# Altium project Unixtime Watch.PrjPcb
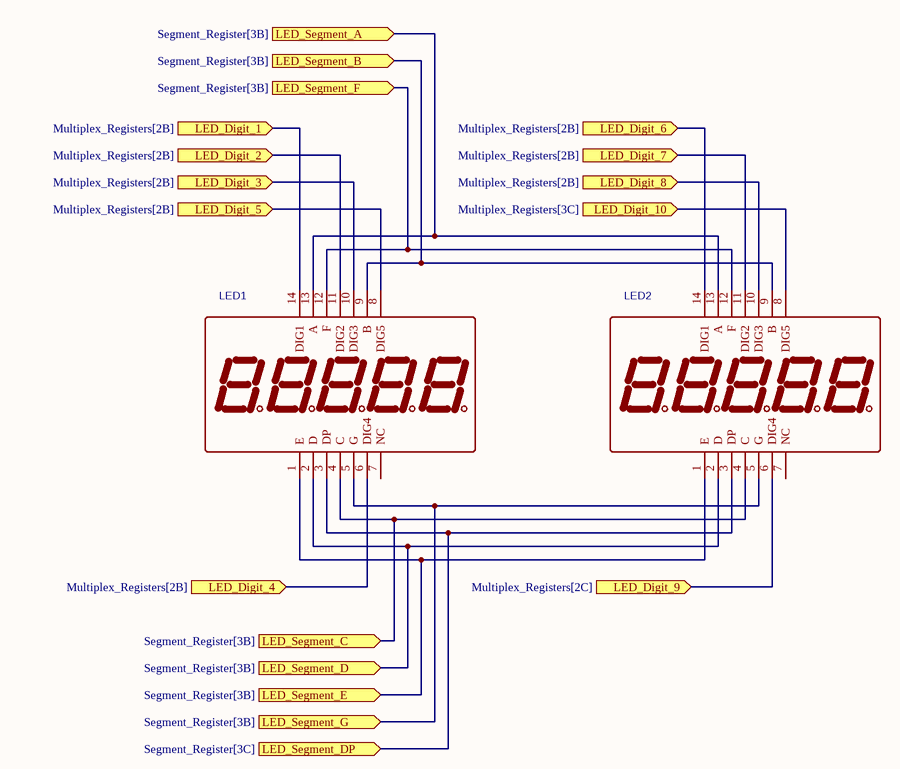
[diagram p0: LEDs.SchDoc]
6 sheets, 32 parts. Net scope: flat (ports and power ports of the same name join across sheets).
Board file: PCB1.PcbDoc
Sheets:
  LEDs.SchDoc
  Multiplex_Registers.SchDoc
  Segment_Register.SchDoc
  Micro.SchDoc
  Power_Management.SchDoc
  RV-3028.SchDoc

## Sheet LEDs.SchDoc
size A; SheetNumber: 1; SheetTotal: 6

### Parts
LED1  SLR0365CRA1BD/AFN-3651A  [LED-SEG-TH_SLR0365CRA1BD-AFN-3651A]  (value not drawn)
LED2  SLR0365CRA1BD/AFN-3651A  [LED-SEG-TH_SLR0365CRA1BD-AFN-3651A]  (value not drawn)

### Ports
LED_Digit_1 (in, see Multiplex_Registers[2B]), LED_Digit_2 (in, see Multiplex_Registers[2B]), LED_Digit_3 (in, see Multiplex_Registers[2B]), LED_Digit_4 (in, see Multiplex_Registers[2B]), LED_Digit_5 (in, see Multiplex_Registers[2B]), LED_Digit_6 (in, see Multiplex_Registers[2B]), LED_Digit_7 (in, see Multiplex_Registers[2B]), LED_Digit_8 (in, see Multiplex_Registers[2B]), LED_Digit_9 (in, see Multiplex_Registers[2C]), LED_Digit_10 (in, see Multiplex_Registers[3C]), LED_Segment_A (in, see Segment_Register[3B]), LED_Segment_B (in, see Segment_Register[3B]), LED_Segment_C (in, see Segment_Register[3B]), LED_Segment_D (in, see Segment_Register[3B]), LED_Segment_DP (in, see Segment_Register[3C]), LED_Segment_E (in, see Segment_Register[3B]), LED_Segment_F (in, see Segment_Register[3B]), LED_Segment_G (in, see Segment_Register[3B])

### Nets
NetLED1_1: LED1.1(E) LED2.1(E) ; port LED_Segment_E
NetLED1_2: LED1.2(D) LED2.2(D) ; port LED_Segment_D
NetLED1_3: LED1.3(DP) LED2.3(DP) ; port LED_Segment_DP
NetLED1_4: LED1.4(C) LED2.4(C) ; port LED_Segment_C
NetLED1_5: LED1.5(G) LED2.5(G) ; port LED_Segment_G
NetLED1_6: LED1.6(DIG4) ; port LED_Digit_4
NetLED1_8: LED1.8(DIG5) ; port LED_Digit_5
NetLED1_9: LED1.9(B) LED2.9(B) ; port LED_Segment_B
NetLED1_10: LED1.10(DIG3) ; port LED_Digit_3
NetLED1_11: LED1.11(DIG2) ; port LED_Digit_2
NetLED1_12: LED1.12(F) LED2.12(F) ; port LED_Segment_F
NetLED1_13: LED1.13(A) LED2.13(A) ; port LED_Segment_A
NetLED1_14: LED1.14(DIG1) ; port LED_Digit_1
NetLED2_6: LED2.6(DIG4) ; port LED_Digit_9
NetLED2_8: LED2.8(DIG5) ; port LED_Digit_10
NetLED2_10: LED2.10(DIG3) ; port LED_Digit_8
NetLED2_11: LED2.11(DIG2) ; port LED_Digit_7
NetLED2_14: LED2.14(DIG1) ; port LED_Digit_6

Not connected (* = marked no-connect by the designer): LED1 7(NC); LED2 7(NC)

### Library data of the parts
LED1 LED2 = SLR0365CRA1BD/AFN-3651A: BOM_Manufacturer: SUNLIGHT; Contributor: LCSC; BOM_Supplier: LCSC; BOM_Supplier Part: C225969; BOM_Manufacturer Part: SLR0365CRA1BD/AFN-3651A; BOM_JLCPCB Part Class: Extended Part; spicePre: L; spiceSymbolName: SLR0365CRA1BD/AFN-3651A

## Sheet Multiplex_Registers.SchDoc
size A; SheetNumber: 2; SheetTotal: 5
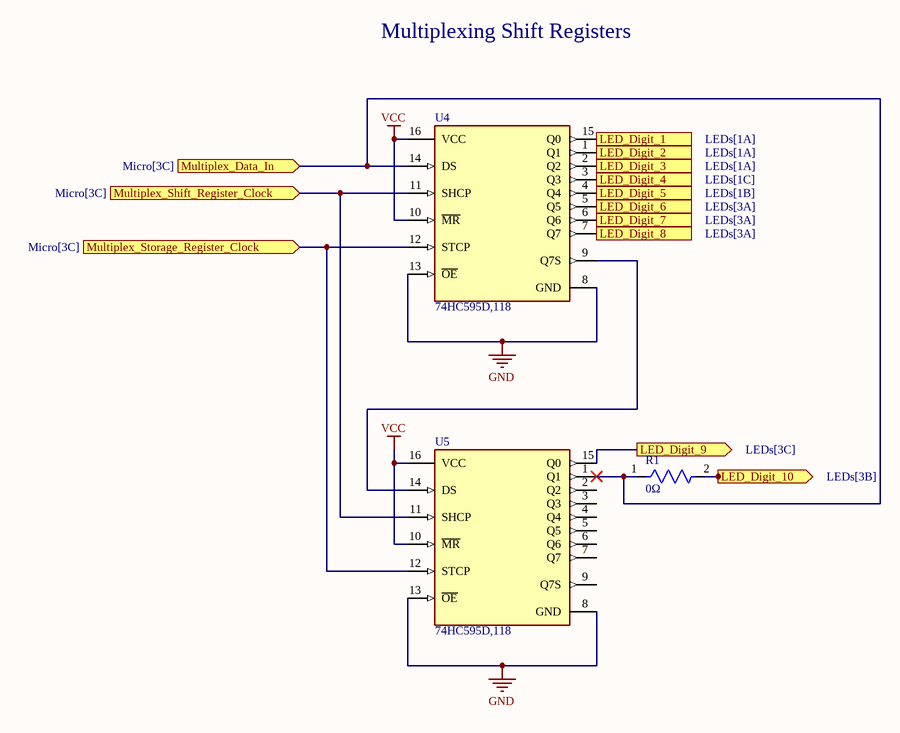
[diagram p1: Multiplex_Registers.SchDoc]

### Parts
R1  CRCW04020000Z0ED  [FP-CRCW0402-e3-IPC_C]  (value not drawn)
U4  74HC595D,118  [FP-SOT109-1-IPC_C]
U5  74HC595D,118  [FP-SOT109-1-IPC_C]

### Ports
LED_Digit_1 (out, see LEDs[1A]), LED_Digit_2 (out, see LEDs[1A]), LED_Digit_3 (out, see LEDs[1A]), LED_Digit_4 (out, see LEDs[1C]), LED_Digit_5 (out, see LEDs[1B]), LED_Digit_6 (out, see LEDs[3A]), LED_Digit_7 (out, see LEDs[3A]), LED_Digit_8 (out, see LEDs[3A]), LED_Digit_9 (out, see LEDs[3C]), LED_Digit_10 (out, see LEDs[3B]), Multiplex_Data_In (in, see Micro[3C]), Multiplex_Shift_Register_Clock (in, see Micro[3C]), Multiplex_Storage_Register_Clock (in, see Micro[3C])

### Nets
GND: U4.8(GND) U4.13(~{OE}) U5.8(GND) U5.13(~{OE})
VCC: U4.10(~{MR}) U4.16(VCC) U5.10(~{MR}) U5.16(VCC)
NetLED1_6: U4.3(Q3) ; port LED_Digit_4
NetLED1_8: U4.4(Q4) ; port LED_Digit_5
NetLED1_10: U4.2(Q2) ; port LED_Digit_3
NetLED1_11: U4.1(Q1) ; port LED_Digit_2
NetLED1_14: U4.15(Q0) ; port LED_Digit_1
NetLED2_6: U5.15(Q0) ; port LED_Digit_9
NetLED2_8: R1.2 ; port LED_Digit_10
NetLED2_10: U4.7(Q7) ; port LED_Digit_8
NetLED2_11: U4.6(Q6) ; port LED_Digit_7
NetLED2_14: U4.5(Q5) ; port LED_Digit_6
NetR1_1: R1.1 U4.14(DS) U5.1(Q1) ; port Multiplex_Data_In
NetU4_9: U4.9(Q7S) U5.14(DS)
NetU_12: U4.12(STCP) U5.12(STCP) ; port Multiplex_Storage_Register_Clock
NetU_25: U4.11(SHCP) U5.11(SHCP) ; port Multiplex_Shift_Register_Clock

Not connected (* = marked no-connect by the designer): U5 2(Q2) 3(Q3) 4(Q4) 5(Q5) 6(Q6) 7(Q7) 9(Q7S)

### Notes on the sheet
- Multiplexing Shift Registers
- (near R1) 0Ω

### Library data of the parts
R1 = CMP-2002-08122-2: RES Thick Film, 0Ω, 0.063W, 0402; Tolerance: 5%; Max Power Dissipation: 63mW; Voltage Rating: 50V; Temperature Coefficient: 100ppm/°C; Resistance: 0mR; Contact Plating: Tin; Height: 0.35mm; Radiation Hardening: No; Features: Automotive AEC-Q200; Composition: Thick Film; Width: 0.5mm; Weight: 2.3E-05oz; Termination: SMD/SMT; Packaging: Tape and Reel; Mount: Surface Mount; Case Code (Metric): 1005; Military Standard: Not; Min Operating Temperature: -55°C; Number of Terminations: 2; Package Quantity: 1; Case Code (Imperial): 0402; Depth: 0.5mm; Max Operating Temperature: 155°C; Case/Package: 0402; Power Rating: 63mW; Lead Free: Lead Free; Voltage Rating (DC): 50V; Length: 1mm
U4 U5 = CMP-14351-000006-1: IC SHIFT REGISTER 8BIT 16SOIC; RoHS Compliant: Yes

## Sheet Segment_Register.SchDoc
size A; SheetNumber: 3; SheetTotal: 5
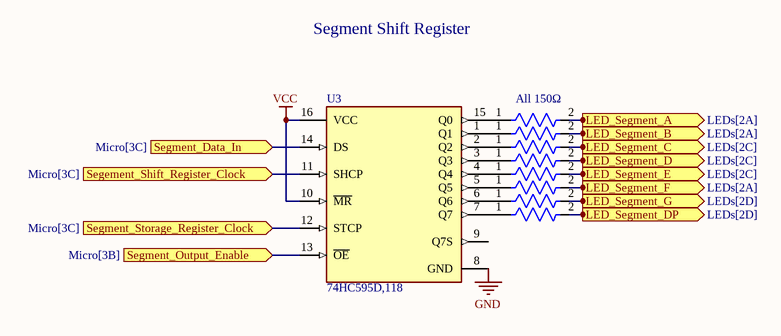
[diagram p2: Segment_Register.SchDoc]

### Parts
R2  CRCW0402150RFKED  [FP-CRCW0402-e3-IPC_A]  (value not drawn)
R3  CRCW0402150RFKED  [FP-CRCW0402-e3-IPC_A]  (value not drawn)
R4  CRCW0402150RFKED  [FP-CRCW0402-e3-IPC_A]  (value not drawn)
R5  CRCW0402150RFKED  [FP-CRCW0402-e3-IPC_A]  (value not drawn)
R6  CRCW0402150RFKED  [FP-CRCW0402-e3-IPC_A]  (value not drawn)
R7  CRCW0402150RFKED  [FP-CRCW0402-e3-IPC_A]  (value not drawn)
R8  CRCW0402150RFKED  [FP-CRCW0402-e3-IPC_A]  (value not drawn)
R9  CRCW0402150RFKED  [FP-CRCW0402-e3-IPC_A]  (value not drawn)
U3  74HC595D,118  [FP-SOT109-1-IPC_C]

### Ports
LED_Segment_A (out, see LEDs[2A]), LED_Segment_B (out, see LEDs[2A]), LED_Segment_C (out, see LEDs[2C]), LED_Segment_D (out, see LEDs[2C]), LED_Segment_DP (out, see LEDs[2D]), LED_Segment_E (out, see LEDs[2C]), LED_Segment_F (out, see LEDs[2A]), LED_Segment_G (out, see LEDs[2D]), Segement_Shift_Register_Clock (in, see Micro[3C]), Segment_Data_In (in, see Micro[3C]), Segment_Output_Enable (in, see Micro[3B]), Segment_Storage_Register_Clock (in, see Micro[3C])

### Nets
GND: U3.8(GND)
VCC: U3.10(~{MR}) U3.16(VCC)
NetLED1_1: R6.2 ; port LED_Segment_E
NetLED1_2: R5.2 ; port LED_Segment_D
NetLED1_3: R9.2 ; port LED_Segment_DP
NetLED1_4: R4.2 ; port LED_Segment_C
NetLED1_5: R8.2 ; port LED_Segment_G
NetLED1_9: R3.2 ; port LED_Segment_B
NetLED1_12: R7.2 ; port LED_Segment_F
NetLED1_13: R2.2 ; port LED_Segment_A
NetR2_1: R2.1 U3.15(Q0)
NetR3_1: R3.1 U3.1(Q1)
NetR4_1: R4.1 U3.2(Q2)
NetR5_1: R5.1 U3.3(Q3)
NetR6_1: R6.1 U3.4(Q4)
NetR7_1: R7.1 U3.5(Q5)
NetR8_1: R8.1 U3.6(Q6)
NetR9_1: R9.1 U3.7(Q7)
NetU_10: U3.13(~{OE}) ; port Segment_Output_Enable
NetU_11: U3.12(STCP) ; port Segment_Storage_Register_Clock
NetU_13: U3.14(DS) ; port Segment_Data_In
NetU_14: U3.11(SHCP) ; port Segement_Shift_Register_Clock

Not connected (* = marked no-connect by the designer): U3 9(Q7S)

### Notes on the sheet
- Segment Shift Register
- (near R2) All 150Ω

### Library data of the parts
R2-R9 = CMP-2002-08214-2: RES Thick Film, 150Ω, 1%, 0.063W, 100ppm/°C, 0402; Power Rating: 63mW; Voltage Rating: 50V; Resistance: 150R; Packaging: Tape and Reel; Height: 0.35mm; Radiation Hardening: No; Min Operating Temperature: -55°C; Mount: Surface Mount; Contact Plating: Tin; Case/Package: 0402; Width: 0.5mm; Case Code (Imperial): 0402; Length: 1mm; Tolerance: 1%; Lead Free: Lead Free; Case Code (Metric): 1005; Military Standard: Not; Max Operating Temperature: 155°C; Temperature Coefficient: 100ppm/°C; Weight: 2.3E-05oz; Voltage Rating (DC): 50V; Depth: 0.5mm; Package Quantity: 10000; Composition: Thick Film; Termination: SMD/SMT
U3 = CMP-14351-000006-1: IC SHIFT REGISTER 8BIT 16SOIC; RoHS Compliant: Yes

## Sheet Micro.SchDoc
size A; SheetNumber: 4; SheetTotal: 6
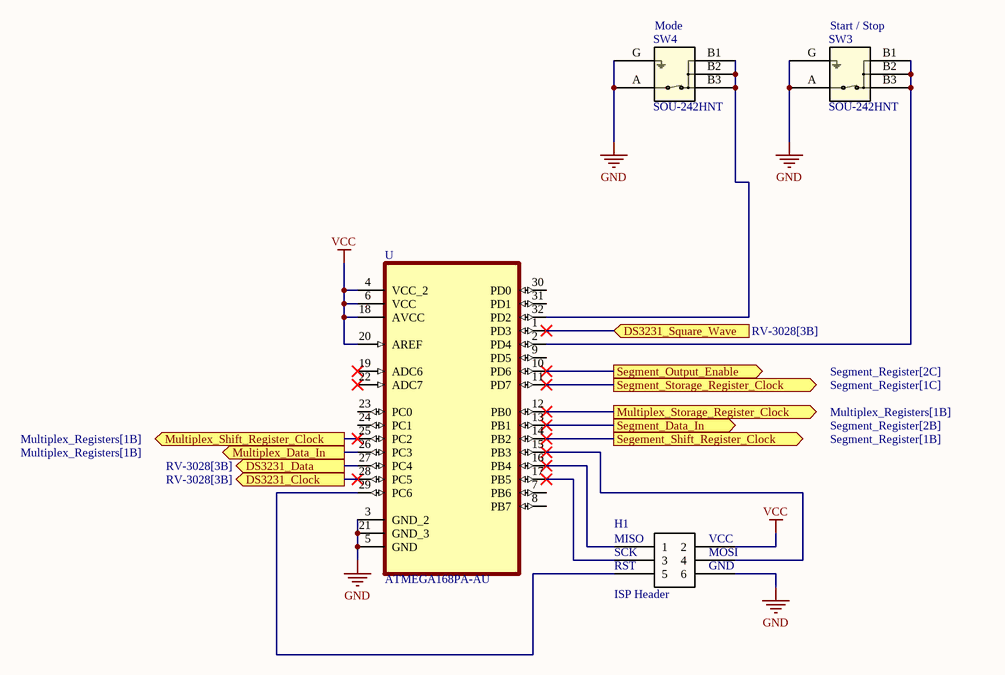
[diagram p3: Micro.SchDoc]

### Parts
H1  ISP Header  [ISP Header]
SW3  SOU-242HNT  [SOU-242HNT_MIT]
SW4  SOU-242HNT  [SOU-242HNT_MIT]
U  ATMEGA168PA-AU  [QFP80P900X900X120-32N]

### Ports
DS3231_Clock (out, see RV-3028[3B]), DS3231_Data (out, see RV-3028[3B]), DS3231_Square_Wave (in, see RV-3028[3B]), Multiplex_Data_In (out, see Multiplex_Registers[1B]), Multiplex_Shift_Register_Clock (out, see Multiplex_Registers[1B]), Multiplex_Storage_Register_Clock (out, see Multiplex_Registers[1B]), Segement_Shift_Register_Clock (out, see Segment_Register[1B]), Segment_Data_In (out, see Segment_Register[2B]), Segment_Output_Enable (out, see Segment_Register[2C]), Segment_Storage_Register_Clock (out, see Segment_Register[1C])

### Nets
GND: H1.6 SW3.A SW3.G SW4.A SW4.G U.3(GND_2) U.5(GND) U.21(GND_3)
VCC: H1.2 U.4(VCC_2) U.6(VCC) U.18(AVCC) U.20(AREF)
NetH1_1: H1.1 U.16(PB4)
NetH1_3: H1.3 U.17(PB5)
NetH1_4: H1.4 U.15(PB3)
NetH1_5: H1.5 U.29(PC6)
NetR1_1: U.26(PC3) ; port Multiplex_Data_In
NetSW3_B1: SW3.B1 SW3.B2 SW3.B3 U.2(PD4)
NetSW4_B1: SW4.B1 SW4.B2 SW4.B3 U.32(PD2)
NetU_1: U.1(PD3) ; port DS3231_Square_Wave
NetU_10: U.10(PD6) ; port Segment_Output_Enable
NetU_11: U.11(PD7) ; port Segment_Storage_Register_Clock
NetU_12: U.12(PB0) ; port Multiplex_Storage_Register_Clock
NetU_13: U.13(PB1) ; port Segment_Data_In
NetU_14: U.14(PB2) ; port Segement_Shift_Register_Clock
NetU_25: U.25(PC2) ; port Multiplex_Shift_Register_Clock
NetU_27: U.27(PC4) ; port DS3231_Data
NetU_28: U.28(PC5) ; port DS3231_Clock

Not connected (* = marked no-connect by the designer): U 7(PB6) 8(PB7) 9(PD5) 19(ADC6)* 22(ADC7)* 23(PC0) 24(PC1) 30(PD0) 31(PD1)

### Notes on the sheet
- (near SW4) Mode
- (near SW3) Start / Stop
- (in symbol ISP Header) MISO; VCC; SCK; MOSI; RST; GND

### Library data of the parts
SW3 SW4 = SOU-242HNT: SWITCH TACTILE, SPST-NO, 0.05A 1; Mfr_Name: Mitsumi; Copyright: Copyright (C) 2022 Ultra Librarian. All rights reserved.; Manufacturer_Part_Number: SOU-242HNT; Digi-Key_Part_Number_1: 12-SOU-242HNTTR-ND; Digi-Key_Part_Number_2: 12-SOU-242HNTCT-ND; Digi-Key_Part_Number_3: 12-SOU-242HNTDKR-ND; RefDes: RefDes; Type: DEV; Supplier 1: Digi-Key; Supplier 2: Digi-Key; Supplier 3: Digi-Key
U = ATMEGA168PA-AU: AVR AVRÂ® ATmega Microcontroller IC 8-Bit 20MHz 16KB _8K x 16_ FLASH 32-TQFP _7x7_; MF: Microchip; SnapEDA_Link: https://www.snapeda.com/parts/ATMEGA168PA-AU/Microchip/view-part/1772950/?ref=snap; Price: None; Availability: Unavailable; MP: ATMEGA168PA-AU; Value: *; Package: TQFP-32 Microchip

## Sheet Power_Management.SchDoc
size A; SheetNumber: 5; SheetTotal: 6
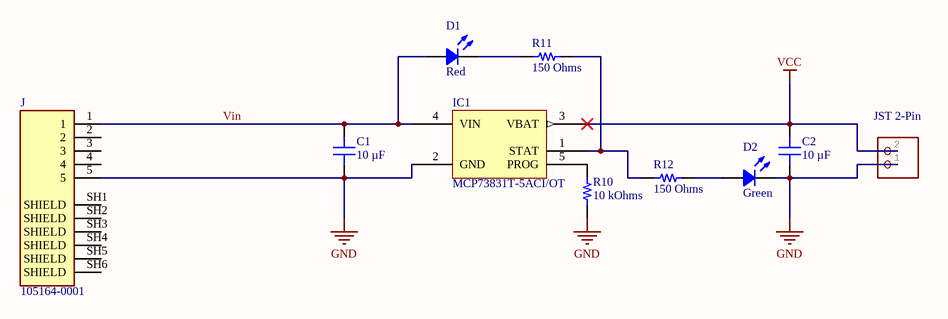
[diagram p4: Power_Management.SchDoc]

### Parts
C1  10 µF  [CAP 0402_1005]
C2  10 µF  [CAP 0402_1005]
CN1  JSTPH  [Lazy-JST]  (value not drawn)
D1  Red  [LED 0402_1005 RED]
D2  Green  [LED 0402_1005 GREEN]
IC1  MCP73831T-5ACI/OT  [MICROCHIP SOT-23-5 OT]
J  105164-0001  [MOLEX_105164-0001]
R10  10 kOhms  [RES 0201_0603]
R11  150 Ohms  [RES 0201_0603]
R12  150 Ohms  [RES 0201_0603]

### Nets
GND: C1.1 C2.1 CN1.1 D2.2 IC1.2(GND) J.5 R10.1
VCC: C2.2 CN1.2 IC1.3(VBAT)
Vin: C1.2 D1.1 IC1.4(VIN) J.1
NetD1_2: D1.2 R11.1
NetD2_1: D2.1 R12.2
NetIC1_1: IC1.1(STAT) R11.2 R12.1
NetIC1_5: IC1.5(PROG) R10.2

Not connected (* = marked no-connect by the designer): J 2 3 4 SH1(SHIELD) SH2(SHIELD) SH3(SHIELD) SH4(SHIELD) SH5(SHIELD) SH6(SHIELD)

### Notes on the sheet
- (near CN1) JST 2-Pin

### Library data of the parts
C1 C2 = CL05A106MQ5NUNC: CAP CER 10UF 6.3V X5R 0402; manufacturer: Samsung Electro-Mechanics; Tolerance: ±20%; Part Number: CL05A106MQ5NUNC; Value: 10 µF; Applications: General Purpose; Capacitance: 10 µF; componentlink1description: Datasheet; componentlink1url: http://www.samsungsem.com/kr/support/product-search/mlcc/CL05A106MQ5NUNC.jsp; componentlink2description: DigiKey Link; componentlink2url: https://www.digikey.com/en/products/detail/samsung-electro-mechanics/CL05A106MQ5NUNC/3887109; Device Package: 0402 (1005 Metric); lastupdated: 7/26/2022 2:28:04 AM; Lifecycle Status: Active; Minimum Order: 1; Mounting Type: Surface Mount, MLCC; Operating Temperature: -55°C ~ 85°C; Package / Case: 0402 (1005 Metric); packaging: TapeAndReel; partid: 1766; Part Status: Active; price: 0.03; series: CL; Size / Dimension: 0.039" L x 0.020" W (1.00mm x 0.50mm); Supplier 1: DigiKey; Supplier Part Number 1: 1276-1451-1-ND; Temperature Coefficient: X5R; Thickness (Max): 0.028" (0.70mm); Voltage - Rated: 6.3V
CN1 = JST_2PIN: JST 2-Pin Right-Angle Connector  PH-Series - 4UConnector: 17311  SH-Series - 4UConnector: 07278; GateName_1: G$1; SymbolName_1: PINHD2; LibraryName: microbuilder; DeviceSetName: JST_2PIN
D1 = APHHS1005SURCK: LED RED CLEAR CHIP SMD; Manufacturer: Kingbright; Configuration: Standard; Current - Test: 20mA; Lens Color: Colorless; Lens Size: 0.80mm x 0.50mm; Lens Style: Rectangle with Flat Top; Millicandela Rating: 70mcd; Viewing Angle: 120°; Voltage - Forward (Vf) (Typ): 1.95V; Wavelength - Dominant: 630nm; Wavelength - Peak: 645nm; Part Number: APHHS1005SURCK; Color: Red; ComponentLink1Description: Datasheet; ComponentLink1URL: http://www.kingbrightusa.com/images/catalog/SPEC/APHHS1005SURCK.pdf; ComponentLink2Description: DigiKey Link; ComponentLink2URL: https://www.digikey.com/en/products/detail/kingbright/APHHS1005SURCK/1747502; Device Package: 0402 (1005 Metric); Height (Max): 0.60mm; LastUpdated: 7/29/2022 2:39:04 PM; Lens Transparency: Clear; Lifecycle Status: Active; Minimum Order: 1; Mounting Type: Surface Mount; Package / Case: 0402 (1005 Metric); Packaging: TapeAndReel; PartId: 520; Part Status: Active; Price: 0.09; Series: -; Size / Dimension: 1.00mm L x 0.50mm W; Supplier 1: DigiKey; Supplier Part Number 1: 754-1104-1-ND; Supplier Device Package: Chip LED; Value: Red
D2 = APHHS1005CGCK: LED GREEN CLEAR CHIP SMD; Manufacturer: Kingbright; Configuration: Standard; Current - Test: 20mA; Lens Color: Colorless; Lens Size: 0.80mm x 0.50mm; Lens Style: Rectangle with Flat Top; Millicandela Rating: 50mcd; Viewing Angle: 120°; Voltage - Forward (Vf) (Typ): 2.1V; Wavelength - Dominant: 570nm; Wavelength - Peak: 574nm; Part Number: APHHS1005CGCK; Color: Green; ComponentLink1Description: Datasheet; ComponentLink1URL: http://www.kingbrightusa.com/images/catalog/SPEC/APHHS1005CGCK.pdf; ComponentLink2Description: DigiKey Link; ComponentLink2URL: https://www.digikey.com/en/products/detail/kingbright/APHHS1005CGCK/1747499; Device Package: 0402 (1005 Metric); Height (Max): 0.60mm; LastUpdated: 7/29/2022 2:38:46 PM; Lens Transparency: Clear; Lifecycle Status: Active; Minimum Order: 1; Mounting Type: Surface Mount; Package / Case: 0402 (1005 Metric); Packaging: TapeAndReel; PartId: 713; Part Status: Active; Price: 0.07; Series: -; Size / Dimension: 1.00mm L x 0.50mm W; Supplier 1: DigiKey; Supplier Part Number 1: 754-1101-1-ND; Supplier Device Package: Chip LED; Value: Green
IC1 = MCP73831T-5ACI/OT: IC CONTRLR LI-ION 4.50V SOT23-5; Part Number: MCP73831T-5ACI/OT
J = 105164-0001: USB - micro B USB 2.0 Receptacle Connector 5 Position Surface Mount, Right Angle; Through Hole; MP: 1051640001; MF: Molex; Price: None; Package: None; Value: *; Availability: Unavailable; SnapEDA_Link: https://www.snapeda.com/parts/1051640001/Molex/view-part/1758198/?ref=snap
R10 = RC0201FR-0710KL: RES 10K OHM 1% 1/20W 0201; Manufacturer: Yageo; Power (Watts): 0.05W, 1/20W; Temperature Coefficient: ±200ppm/°C; Part Number: RC0201FR-0710KL; Value: 10 kOhms; ComponentLink1Description: Datasheet; ComponentLink1URL: https://www.yageo.com/upload/media/product/productsearch/datasheet/rchip/PYu-RC_Group_51_RoHS_L_10.pdf; ComponentLink2Description: DigiKey Link; ComponentLink2URL: https://www.digikey.com/en/products/detail/yageo/RC0201FR-0710KL/1948870; Composition: Thick Film; Device Package: 0201 (0603 Metric); Features: Moisture Resistant; Height - Seated (Max): 0.010" (0.26mm); LastUpdated: 8/4/2022 4:39:11 AM; Lifecycle Status: Active; Minimum Order: 1; Number of Terminations: 2; Operating Temperature: -55°C ~ 125°C; Package / Case: 0201 (0603 Metric); Packaging: CutTape; PartId: 2281; Part Status: Active; Price: 0.01; Resistance: 10 kOhms; Series: RC_L; Size / Dimension: 0.024" L x 0.012" W (0.60mm x 0.30mm); Supplier 1: DigiKey; Supplier Part Number 1: 311-10.0KMCT-ND; Supplier Device Package: 0201; Tolerance: ±1%
R11 R12 = RC0201FR-07150RL: RES 150 OHM 1% 1/20W 0201; Manufacturer: Yageo; Power (Watts): 0.05W, 1/20W; Temperature Coefficient: ±200ppm/°C; Part Number: RC0201FR-07150RL; Value: 150 Ohms; ComponentLink1Description: Datasheet; ComponentLink1URL: https://www.yageo.com/upload/media/product/productsearch/datasheet/rchip/PYu-RC_Group_51_RoHS_L_10.pdf; ComponentLink2Description: DigiKey Link; ComponentLink2URL: https://www.digikey.com/en/products/detail/yageo/RC0201FR-07150RL/3202385; Composition: Thick Film; Device Package: 0201 (0603 Metric); Features: Moisture Resistant; Height - Seated (Max): 0.010" (0.26mm); LastUpdated: 8/4/2022 4:39:17 AM; Lifecycle Status: Active; Minimum Order: 1; Number of Terminations: 2; Operating Temperature: -55°C ~ 125°C; Package / Case: 0201 (0603 Metric); Packaging: CutTape; PartId: 1399; Part Status: Active; Price: 0.01; Resistance: 150 Ohms; Series: RC_L; Size / Dimension: 0.024" L x 0.012" W (0.60mm x 0.30mm); Supplier 1: DigiKey; Supplier Part Number 1: YAG2273CT-ND; Supplier Device Package: 0201; Tolerance: ±1%

## Sheet RV-3028.SchDoc
size A; SheetNumber: 6; SheetTotal: 6
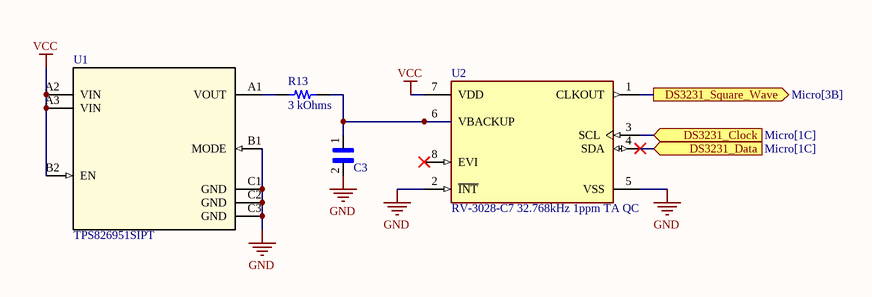
[diagram p5: RV-3028.SchDoc]

### Parts
C3  CPX3225A752D  [CAPCP3225X100N]  (value not drawn)
R13  3 kOhms  [RES 0402_1005]
U1  TPS826951SIPT  [SIP0008A]
U2  RV-3028-C7 32.768kHz 1ppm TA QC  [FP-RV-3028-C7_32_768kHz_1-MFG]

### Ports
DS3231_Clock (in, see Micro[1C]), DS3231_Data (in, see Micro[1C]), DS3231_Square_Wave (out, see Micro[3B])

### Nets
GND: C3.2 U1.B1(MODE) U1.C1(GND) U1.C2(GND) U1.C3(GND) U2.2(~{INT}) U2.5(VSS)
VCC: U1.A2(VIN) U1.A3(VIN) U1.B2(EN) U2.7(VDD)
NetC3_1: C3.1 R13.2 U2.6(VBACKUP)
NetR13_1: R13.1 U1.A1(VOUT)
NetU_1: U2.1(CLKOUT) ; port DS3231_Square_Wave
NetU_27: U2.4(SDA) ; port DS3231_Data
NetU_28: U2.3(SCL) ; port DS3231_Clock

Not connected (* = marked no-connect by the designer): U2 8(EVI)*

### Library data of the parts
C3 = CPX3225A752D: 7.5mF (EDLC) Supercapacitor 2.6V 1210 (3225 Metric) 25Ohm @ 1kHz; MF: Seiko Instruments; Purchase-URL: https://pricing.snapeda.com/search/part/CPX3225A752D/?ref=eda; Package: 1210 Seiko; MP: CPX3225A752D; Value: *; Price: None; Availability: Good; SnapEDA_Link: https://www.snapeda.com/parts/CPX3225A752D/Seiko%20Instruments/view-part/2170187/?ref=snap; Check_prices: https://www.snapeda.com/parts/CPX3225A752D/Seiko%20Instruments/view-part/2170187/?ref=eda
R13 = RC0402FR-073KL: RES 3K OHM 1% 1/16W 0402; Manufacturer: Yageo; Power (Watts): 0.063W, 1/16W; Temperature Coefficient: ±100ppm/°C; Part Number: RC0402FR-073KL; Value: 3 kOhms; ComponentLink1Description: Datasheet; ComponentLink1URL: https://www.yageo.com/upload/media/product/productsearch/datasheet/rchip/PYu-RC_Group_51_RoHS_L_10.pdf; ComponentLink2Description: DigiKey Link; ComponentLink2URL: https://www.digikey.com/en/products/detail/yageo/RC0402FR-073KL/2827586; Composition: Thick Film; Device Package: 0402 (1005 Metric); Features: Moisture Resistant; Height - Seated (Max): 0.016" (0.40mm); LastUpdated: 8/4/2022 4:45:37 AM; Lifecycle Status: Active; Minimum Order: 1; Number of Terminations: 2; Operating Temperature: -55°C ~ 155°C; Package / Case: 0402 (1005 Metric); Packaging: CutTape; PartId: 2489; Part Status: Active; Price: 0.01; Resistance: 3 kOhms; Series: RC_L; Size / Dimension: 0.039" L x 0.020" W (1.00mm x 0.50mm); Supplier 1: DigiKey; Supplier Part Number 1: 311-3KLRCT-ND; Supplier Device Package: 0402; Tolerance: ±1%
U1 = TPS826951SIPT: No Description Available; Mfr_Name: Texas Instruments; Type: DEV; RefDes: RefDes; Copyright: Copyright (C) 2022 Ultra Librarian. All rights reserved.; Manufacturer_Part_Number: TPS826951SIPT; Digi-Key_Part_Number_1: 2156-TPS826951SIPT-ND; Digi-Key_Part_Number_2: 296-TPS826951SIPTCT-ND; Digi-Key_Part_Number_3: 296-TPS826951SIPTDKR-ND; Digi-Key_Part_Number_4: 296-TPS826951SIPTTR-ND; Digi-Key_Part_Number_5: TPS826951SIPT-ND
U2 = CMP-226158-000001-1: Real Time Clock Serial 2byte Clock/Calendar/Alarm/Timer/Battery Backup 8-Pin CSMD T/R; Manufacturer: Micro Crystal; Memory Size: 2Bytes; Number Of Outputs: 1; Nominal Supply Current: 0.04uA; Interface: I2C; Max Supply Voltage: 5.5V; Min Supply Voltage: 1.1V; Package: RV-3028-C7 32.768kHz 1ppm TA QC; Lead Free: Yes; RoHS: TRUE; Device Class L1: Integrated Circuits (ICs); Temperature: -40°C to +85°C; ComponentLink2Description: Datasheet; Height: 0.8mm; Octopart: https://octopart.com/rv-3028-c7+32.768khz+1ppm+ta+qc-micro+crystal-98880451; ComponentLink2URL: https://www.microcrystal.com/fileadmin/Media/Products/RTC/Datasheet/RV-3028-C7.pdf; Device Class L2: Clock and Timing; Temperature Range Low: -40°C; Temperature Range High: +85°C; Automotive: No; Device Class L3: Real Time Clocks; Manufacturer Part Number: RV-3028-C7 32.768kHz 1ppm TA QC; Frequency: 32.768kHz; Ambient Temperature Range High: +85°C; Ambient Temperature Range Low: -40°C; Category: IC; Mouser Description: RV-3028-C7 32.768KHZ 1PPM Ta Qc

## Nets that join several sheets
GND: Multiplex_Registers (U4.8 U4.13 U5.8 U5.13), Segment_Register (U3.8), Micro (8 pins), Power_Management (7 pins), RV-3028 (7 pins)
VCC: Multiplex_Registers (U4.10 U4.16 U5.10 U5.16), Segment_Register (U3.10 U3.16), Micro (5 pins), Power_Management (C2.2 CN1.2 IC1.3), RV-3028 (U1.A2 U1.A3 U1.B2 U2.7)
NetLED1_1: LEDs (LED1.1 LED2.1), Segment_Register (R6.2)
NetLED1_2: LEDs (LED1.2 LED2.2), Segment_Register (R5.2)
NetLED1_3: LEDs (LED1.3 LED2.3), Segment_Register (R9.2)
NetLED1_4: LEDs (LED1.4 LED2.4), Segment_Register (R4.2)
NetLED1_5: LEDs (LED1.5 LED2.5), Segment_Register (R8.2)
NetLED1_6: LEDs (LED1.6), Multiplex_Registers (U4.3)
NetLED1_8: LEDs (LED1.8), Multiplex_Registers (U4.4)
NetLED1_9: LEDs (LED1.9 LED2.9), Segment_Register (R3.2)
NetLED1_10: LEDs (LED1.10), Multiplex_Registers (U4.2)
NetLED1_11: LEDs (LED1.11), Multiplex_Registers (U4.1)
NetLED1_12: LEDs (LED1.12 LED2.12), Segment_Register (R7.2)
NetLED1_13: LEDs (LED1.13 LED2.13), Segment_Register (R2.2)
NetLED1_14: LEDs (LED1.14), Multiplex_Registers (U4.15)
NetLED2_6: LEDs (LED2.6), Multiplex_Registers (U5.15)
NetLED2_8: LEDs (LED2.8), Multiplex_Registers (R1.2)
NetLED2_10: LEDs (LED2.10), Multiplex_Registers (U4.7)
NetLED2_11: LEDs (LED2.11), Multiplex_Registers (U4.6)
NetLED2_14: LEDs (LED2.14), Multiplex_Registers (U4.5)
NetR1_1: Multiplex_Registers (R1.1 U4.14 U5.1), Micro (U.26)
NetU_1: Micro (U.1), RV-3028 (U2.1)
NetU_10: Segment_Register (U3.13), Micro (U.10)
NetU_11: Segment_Register (U3.12), Micro (U.11)
NetU_12: Multiplex_Registers (U4.12 U5.12), Micro (U.12)
NetU_13: Segment_Register (U3.14), Micro (U.13)
NetU_14: Segment_Register (U3.11), Micro (U.14)
NetU_25: Multiplex_Registers (U4.11 U5.11), Micro (U.25)
NetU_27: Micro (U.27), RV-3028 (U2.4)
NetU_28: Micro (U.28), RV-3028 (U2.3)